# Altium schematic sheet [11] SD.SchDoc: MicroSD slot
size A4; Engineer: M. Folejewski; DocumentNumber: 11; SheetNumber: 11; SheetTotal: 15; PageSize: A4; Designators: 600-699
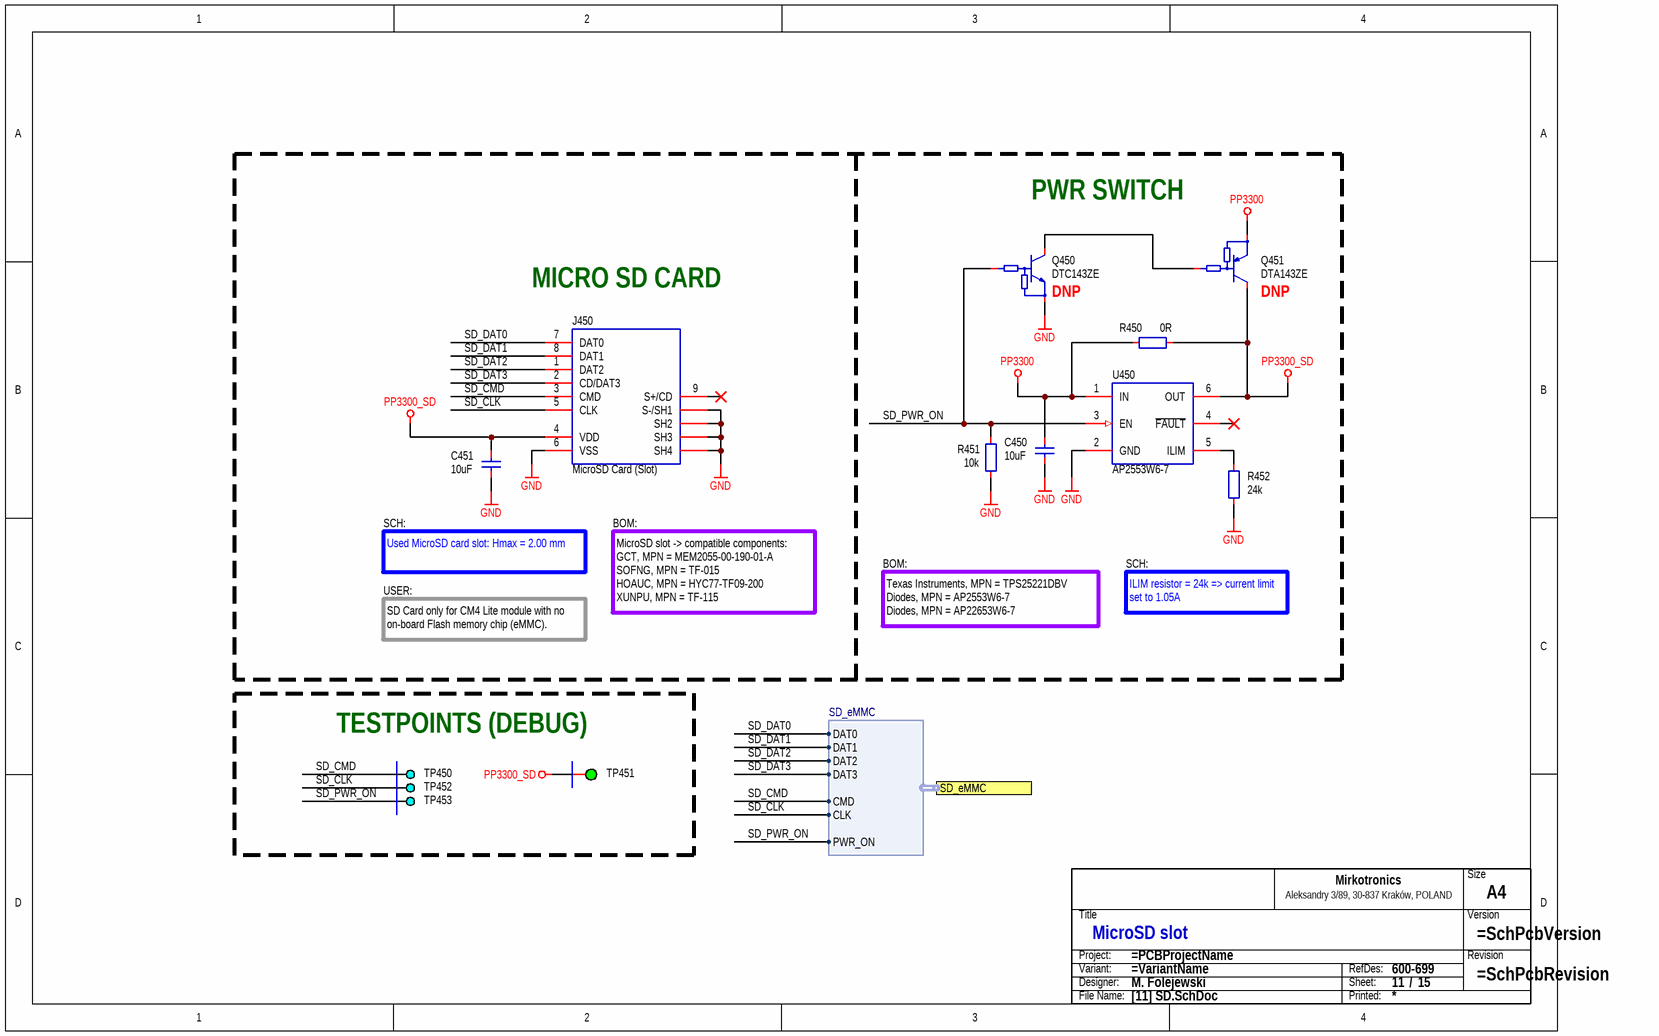
[diagram p0: [11] SD.SchDoc]

## Parts
C450  10uF  [CAP_0603_R]
C451  10uF  [CAP_0603_R]
J450  MicroSD Card (Slot)  [CON_GCT_MEM2055_R]
Q450  DTC143ZE  [PKG_SOT523_SC75_SOT416_P100_R]
Q451  DTA143ZE  [PKG_SOT523_SC75_SOT416_P100_R]
R450  0R  [RES_0603_R]
R451  10k  [RES_0603_R]
R452  24k  [RES_0603_R]
TB?  Title block  (value not drawn)  (graphical)
TP450  DEBUG  [PCB_TP_DBG_50]  (value not drawn)  (no BOM)
TP451  ICT  [PCB_TP_ICT_100]  (value not drawn)  (no BOM)
TP452  DEBUG  [PCB_TP_DBG_50]  (value not drawn)  (no BOM)
TP453  DEBUG  [PCB_TP_DBG_50]  (value not drawn)  (no BOM)
U450  AP2553W6-7  [PKG_SOT23-6]

## Ports
SD_eMMC (harness SD_eMMC)

## Harnesses
SD_eMMC: DAT0, DAT1, DAT2, DAT3, CMD, CLK, PWR_ON

## Nets
GND: C450.1 C451.1 J450.6(VSS) J450.SH1(S-/SH1) J450.SH2 J450.SH3 J450.SH4 Q450.2(E) R451.1 R452.1 U450.2(GND)
PP3300: C450.2 Q451.2(E) R450.2 U450.1(IN)
PP3300_SD: C451.2 J450.4(VDD) Q451.3(C) R450.1 TP451.1 U450.6(OUT)
SD_CLK: J450.5(CLK) TP452.1 ; port SD_eMMC.CLK
SD_CMD: J450.3(CMD) TP450.1 ; port SD_eMMC.CMD
SD_DAT0: J450.7(DAT0) ; port SD_eMMC.DAT0
SD_DAT1: J450.8(DAT1) ; port SD_eMMC.DAT1
SD_DAT2: J450.1(DAT2) ; port SD_eMMC.DAT2
SD_DAT3: J450.2(CD/DAT3) ; port SD_eMMC.DAT3
SD_PWR_ON: Q450.1(B) R451.2 TP453.1 U450.3(EN) ; port SD_eMMC.PWR_ON
NetQ450_3: Q450.3(C) Q451.1(B)
NetR452_2: R452.2 U450.5(ILIM)

Not connected (* = marked no-connect by the designer): J450 9(S+/CD)*; U450 4(~{FAULT})*

## Notes on the sheet
- PWR SWITCH
- (near J450) MICRO SD CARD
- (near Q450) DNP
- (near Q451) DNP
- Used MicroSD card slot: Hmax = 2.00 mm
- SCH:
- BOM:
- SD Card only for CM4 Lite module with no on-board Flash memory chip (eMMC).
- USER:
- MicroSD slot -> compatible components:
  GCT, MPN = MEM2055-00-190-01-A
  SOFNG, MPN = TF-015
  HOAUC, MPN = HYC77-TF09-200
  XUNPU, MPN = TF-115
- Texas Instruments, MPN = TPS25221DBV
  Diodes, MPN = AP2553W6-7
  Diodes, MPN = AP22653W6-7
- ILIM resistor = 24k => current limit set to 1.05A
- TESTPOINTS (DEBUG)
- (in symbol SCH_TITLE_BLOCK_MIRKOTRONICS_V2) Size; Mirkotronics; Aleksandry 3/89, 30-837 Kraków, POLAND; Title; Version; Project:; Revision; Variant:; RefDes:; Designer:; Sheet:; /; File Name:; Printed:

## Library data of the parts
C450 C451 = CAP-0023: Capacitor; MLCC; GENERIC; TBD; TBD; TBD; TBD; SMD; 0603 (1608);; Component Type: Capacitor; Component Subtype: MLCC; Value: 10uF; Manufacturer: GENERIC; MPN: GENERIC; Mounting Type: SMD; Package (Case): 0603 (1608); Supplier: ?
J450 = CON_GCT_MEM2055: Connector; MicroSD Card Connector;; Manufacturer: TF-015; Package (Case): SMD; MPN: TF-015; Value: MicroSD Card (Slot); Component Subtype: MicroSD Card; Component Type: Card Socket; Mounting Type: SMD; Supplier: ?
Q450 = TRA_BJT_NPN_DIG_BEC: Transistor; BJT; NPN; Digital;; Component Subtype: NPN Transistor; Value: DTC143ZE; MPN: DTC143ZE; Component Type: Transistor; Mounting Type: SMD; Supplier: ?
Q451 = TRA_BJT_PNP_DIG_ONS_DTA143ZE: Transistor; BJT; PNP; Digital (Biased);; Manufacturer: On Semiconductor; MPN: DTA143ZET1G; Component Type: Transistor; Mounting Type: SMD; Value: DTA143ZE
R450 R452 = RES-0054: Resistor; Thick Film; GENERIC; TBD; TBD; TBD; TBD; TBD; SMD; 0603 (1608);; Component Type: Resistor; Component Subtype: Thick Film; Manufacturer: GENERIC; MPN: GENERIC; Mounting Type: SMD; Package (Case): 0603 (1608); Supplier: ?
  R450: Value: 0R
  R452: Value: 24k
R451 = RES-0028: Resistor; Thick Film; 10k; 1%; 100mW; 100PPM; 75V; Standard; SMD; 0603 (1608);; Manufacturer: Yageo Corporation; MPN: RC0603FR-0710KL; Component Type: Resistor; Component Subtype: Thick Film; Value: 10k; Mounting Type: SMD; Package (Case): 0603 (1608); Supplier: ?
TB? = SCH_TITLE_BLOCK_MIRKOTRONICS_V2: Component Type: Title block; Manufacturer: -; Mounting Type: Non component; MPN: -; Operating Temperature: -; Package: -; Specification: Title block; Value: Title block; Replacement: -; System: ?
TP450 TP452 TP453 = PCB_TP_DBG: PCB Marking; Test Point (Debug);; Value: DEBUG; Component Subtype: -; Component Type: Testpoint; Mounting Type: -; Supplier: ?
TP451 = PCB_TP_ICT: Test Point (ICT); Specification: Testpoint (for ICT), SMD pad; Component Type: Testpoint (for ICT); Manufacturer: -; Mounting Type: Non component; MPN: -; Value: ICT
U450 = ICC_TXI_TPS25221_DBV: IC; Current Limited Switch;; Manufacturer: Diodes Incorporated; Package (Case): SOT26; MPN: AP2553W6-7; Value: AP2553W6-7; Component Subtype: Current Limited Switch; Component Type: IC; Mounting Type: SMD; Supplier: ?